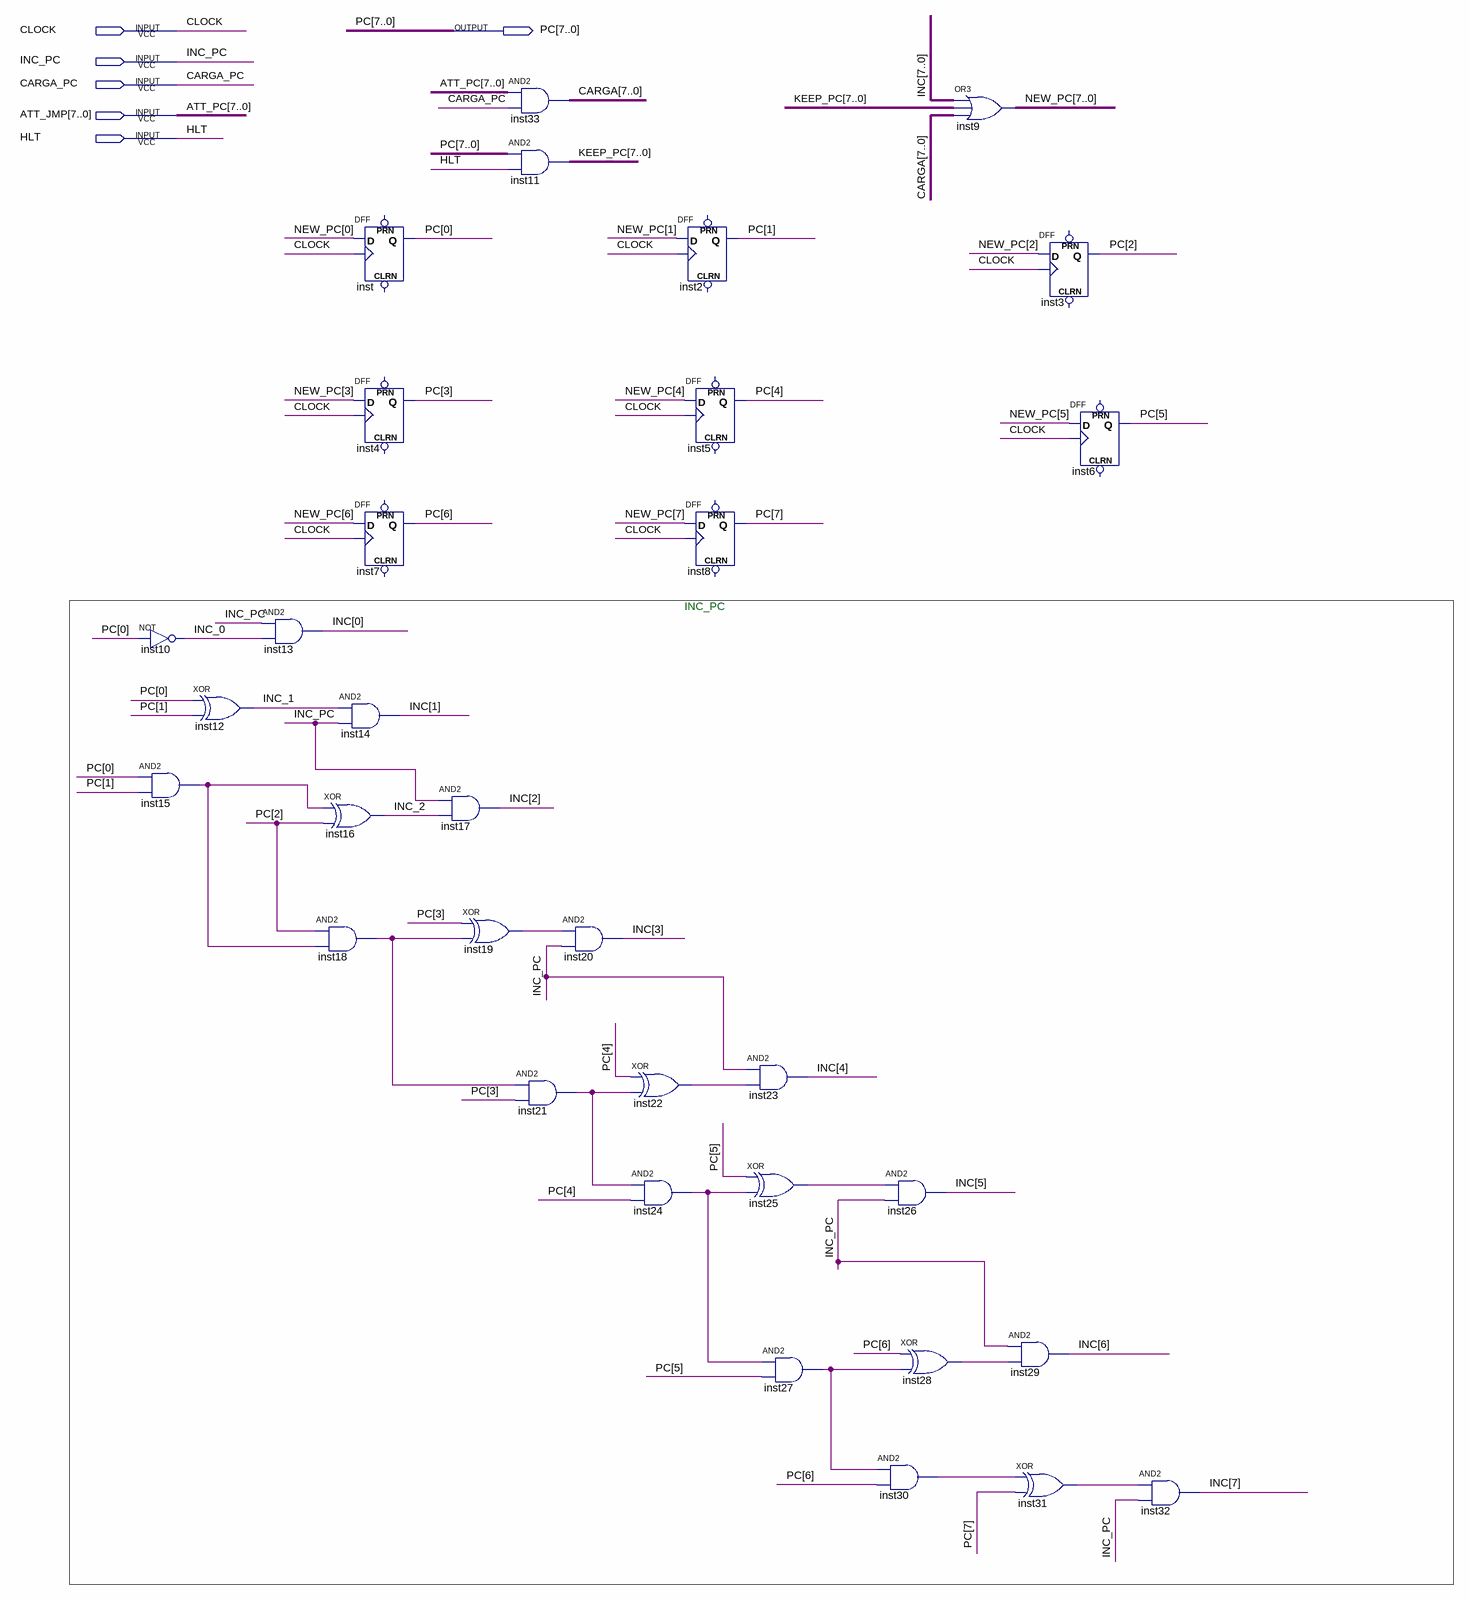
[diagram p0: schematic sheet]
// Quartus schematic PC.bdf as structural Verilog: 33 symbols, 6 pins
module PC (
  input  CLOCK,
  input  INC_PC,
  input  CARGA_PC,
  input  [7:0] ATT_JMP,
  input  HLT,
  output [7:0] PC
);

  wire INC_0, INC_1, INC_2, inst15_out, inst18_out, inst19_out, inst21_out, inst22_out, inst24_out,
       inst25_out, inst27_out, inst28_out, inst30_out, inst31_out;
  wire [7:0] CARGA, INC, KEEP_PC, NEW_PC;

  not inst10 (INC_0, PC[0]);
  xor inst12 (INC_1, PC[0], PC[1]);
  and inst15 (inst15_out, PC[0], PC[1]);
  and inst13 (INC[0], INC_PC, INC_0);
  and inst18 (inst18_out, PC[2], inst15_out);
  DFF inst (.CLK(CLOCK), .D(NEW_PC[0]), .Q(PC[0]));  // open: CLRN, PRN
  DFF inst4 (.CLK(CLOCK), .D(NEW_PC[3]), .Q(PC[3]));  // open: CLRN, PRN
  DFF inst7 (.CLK(CLOCK), .D(NEW_PC[6]), .Q(PC[6]));  // open: CLRN, PRN
  and inst14 (INC[1], INC_1, INC_PC);
  xor inst16 (INC_2, inst15_out, PC[2]);
  and inst17 (INC[2], INC_PC, INC_2);
  xor inst19 (inst19_out, PC[3], inst18_out);
  assign CARGA = ATT_JMP & {8{CARGA_PC}};  // AND2 inst33, 8 bits wide
  assign KEEP_PC = PC & {8{HLT}};  // AND2 inst11, 8 bits wide
  and inst20 (INC[3], inst19_out, INC_PC);
  and inst21 (inst21_out, inst18_out, PC[3]);
  DFF inst2 (.CLK(CLOCK), .D(NEW_PC[1]), .Q(PC[1]));  // open: CLRN, PRN
  DFF inst5 (.CLK(CLOCK), .D(NEW_PC[4]), .Q(PC[4]));  // open: CLRN, PRN
  DFF inst8 (.CLK(CLOCK), .D(NEW_PC[7]), .Q(PC[7]));  // open: CLRN, PRN
  xor inst22 (inst22_out, PC[4], inst21_out);
  and inst24 (inst24_out, inst21_out, PC[4]);
  and inst23 (INC[4], INC_PC, inst22_out);
  xor inst25 (inst25_out, PC[5], inst24_out);
  and inst27 (inst27_out, inst24_out, PC[5]);
  and inst26 (INC[5], inst25_out, INC_PC);
  xor inst28 (inst28_out, PC[6], inst27_out);
  and inst30 (inst30_out, inst27_out, PC[6]);
  assign NEW_PC = INC | KEEP_PC | CARGA;  // OR3 inst9, 8 bits wide
  DFF inst3 (.CLK(CLOCK), .D(NEW_PC[2]), .Q(PC[2]));  // open: CLRN, PRN
  and inst29 (INC[6], INC_PC, inst28_out);
  xor inst31 (inst31_out, inst30_out, PC[7]);
  DFF inst6 (.CLK(CLOCK), .D(NEW_PC[5]), .Q(PC[5]));  // open: CLRN, PRN
  and inst32 (INC[7], inst31_out, INC_PC);

  // Other names for the same wires on the sheet: ATT_PC[7:0] = ATT_JMP

  // Notes on the sheet:
  //   INC_PC
endmodule
